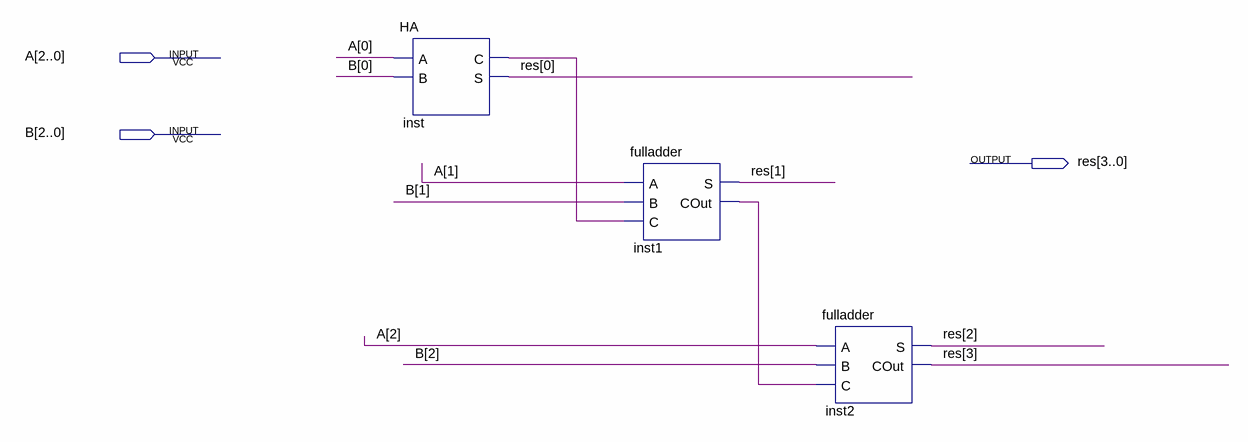
[diagram p0: schematic sheet]
// Quartus schematic 3bitFA.bdf as structural Verilog: 3 symbols, 3 pins
module \3bitFA  (
  input  [2:0] A,
  input  [2:0] B,
  output [3:0] res
);

  wire inst1_cout, inst_c;

  HA inst (.A(A[0]), .B(B[0]), .C(inst_c), .S(res[0]));
  fulladder inst1 (.A(A[1]), .B(B[1]), .C(inst_c), .S(res[1]), .COut(inst1_cout));
  fulladder inst2 (.A(A[2]), .B(B[2]), .C(inst1_cout), .S(res[2]), .COut(res[3]));
endmodule
